# Altium schematic sheet ST_SYS_Board_FPGA.schdoc
size 420 x 297 mm; EDA_Number: ARTIQ; Author: G.Kasprowicz, P. Kulik; CompanyName: WUT ISE; DrawnBy: G.Kasprowicz, P. Kulik; Organization: WUT ISE; DocumentNumber: 7; SheetNumber: 7; ModifiedBy: -; CheckedDate: -; Title2: FPGA; Designer: G.Kasprowicz, P. Kulik; ModifiedDate: -; ProjectName: Sensor Box
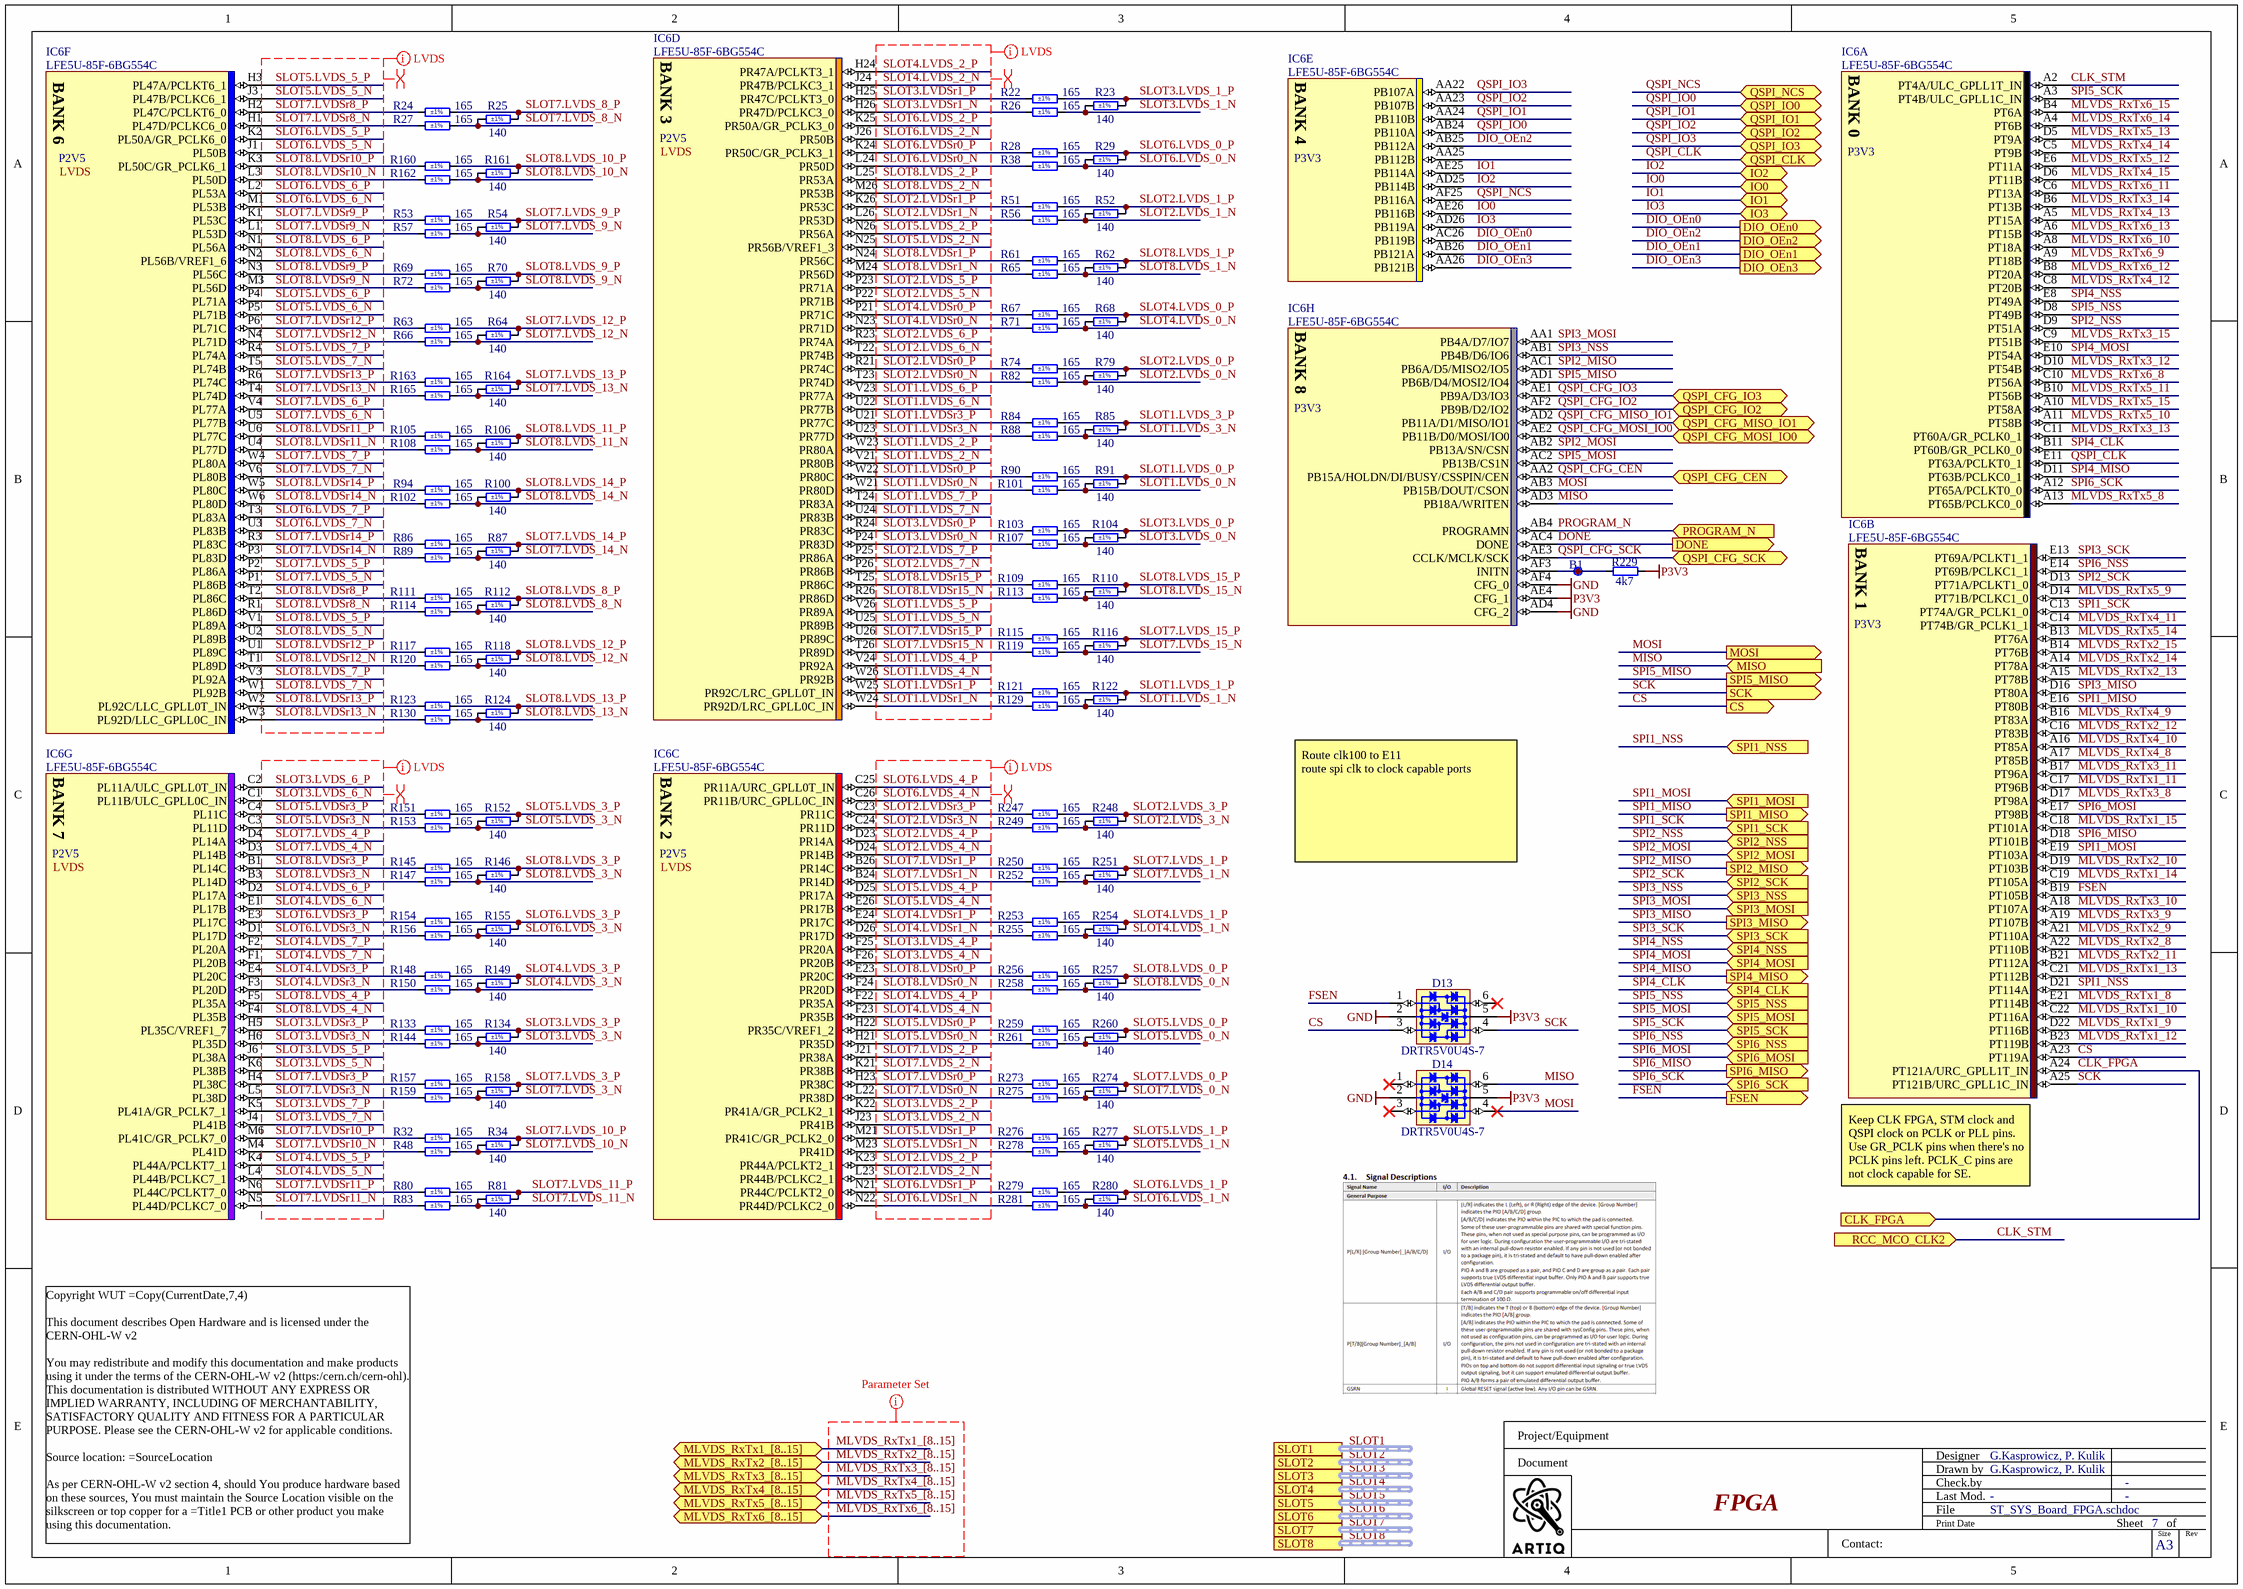
[diagram p0: ST_SYS_Board_FPGA.schdoc]

## Parts
B1  SMD Pad  [C75]  (value not drawn)
D13  DRTR5V0U4S-7  [SOT65P210X110-6N]
D14  DRTR5V0U4S-7  [SOT65P210X110-6N]
IC6  LFE5U-85F-6BG554C  [BGA554C80P26X26_2300X2300X176]  (parts A,B,C,D,E,F,G,H of 15)
R22  165  Tolerance: ±1%  [RESC0603X28N]
R23  140  Tolerance: ±1%  [RESC0603X28N]
R24  165  Tolerance: ±1%  [RESC0603X28N]
R25  140  Tolerance: ±1%  [RESC0603X28N]
R26  165  Tolerance: ±1%  [RESC0603X28N]
R27  165  Tolerance: ±1%  [RESC0603X28N]
R28  165  Tolerance: ±1%  [RESC0603X28N]
R29  140  Tolerance: ±1%  [RESC0603X28N]
R32  165  Tolerance: ±1%  [RESC0603X28N]
R34  140  Tolerance: ±1%  [RESC0603X28N]
R38  165  Tolerance: ±1%  [RESC0603X28N]
R48  165  Tolerance: ±1%  [RESC0603X28N]
R51  165  Tolerance: ±1%  [RESC0603X28N]
R52  140  Tolerance: ±1%  [RESC0603X28N]
R53  165  Tolerance: ±1%  [RESC0603X28N]
R54  140  Tolerance: ±1%  [RESC0603X28N]
R56  165  Tolerance: ±1%  [RESC0603X28N]
R57  165  Tolerance: ±1%  [RESC0603X28N]
R61  165  Tolerance: ±1%  [RESC0603X28N]
R62  140  Tolerance: ±1%  [RESC0603X28N]
R63  165  Tolerance: ±1%  [RESC0603X28N]
R64  140  Tolerance: ±1%  [RESC0603X28N]
R65  165  Tolerance: ±1%  [RESC0603X28N]
R66  165  Tolerance: ±1%  [RESC0603X28N]
R67  165  Tolerance: ±1%  [RESC0603X28N]
R68  140  Tolerance: ±1%  [RESC0603X28N]
R69  165  Tolerance: ±1%  [RESC0603X28N]
R70  140  Tolerance: ±1%  [RESC0603X28N]
R71  165  Tolerance: ±1%  [RESC0603X28N]
R72  165  Tolerance: ±1%  [RESC0603X28N]
R74  165  Tolerance: ±1%  [RESC0603X28N]
R79  140  Tolerance: ±1%  [RESC0603X28N]
R80  165  Tolerance: ±1%  [RESC0603X28N]
R81  140  Tolerance: ±1%  [RESC0603X28N]
R82  165  Tolerance: ±1%  [RESC0603X28N]
R83  165  Tolerance: ±1%  [RESC0603X28N]
R84  165  Tolerance: ±1%  [RESC0603X28N]
R85  140  Tolerance: ±1%  [RESC0603X28N]
R86  165  Tolerance: ±1%  [RESC0603X28N]
R87  140  Tolerance: ±1%  [RESC0603X28N]
R88  165  Tolerance: ±1%  [RESC0603X28N]
R89  165  Tolerance: ±1%  [RESC0603X28N]
R90  165  Tolerance: ±1%  [RESC0603X28N]
R91  140  Tolerance: ±1%  [RESC0603X28N]
R94  165  Tolerance: ±1%  [RESC0603X28N]
R100  140  Tolerance: ±1%  [RESC0603X28N]
R101  165  Tolerance: ±1%  [RESC0603X28N]
R102  165  Tolerance: ±1%  [RESC0603X28N]
R103  165  Tolerance: ±1%  [RESC0603X28N]
R104  140  Tolerance: ±1%  [RESC0603X28N]
R105  165  Tolerance: ±1%  [RESC0603X28N]
R106  140  Tolerance: ±1%  [RESC0603X28N]
R107  165  Tolerance: ±1%  [RESC0603X28N]
R108  165  Tolerance: ±1%  [RESC0603X28N]
R109  165  Tolerance: ±1%  [RESC0603X28N]
R110  140  Tolerance: ±1%  [RESC0603X28N]
R111  165  Tolerance: ±1%  [RESC0603X28N]
R112  140  Tolerance: ±1%  [RESC0603X28N]
R113  165  Tolerance: ±1%  [RESC0603X28N]
R114  165  Tolerance: ±1%  [RESC0603X28N]
R115  165  Tolerance: ±1%  [RESC0603X28N]
R116  140  Tolerance: ±1%  [RESC0603X28N]
R117  165  Tolerance: ±1%  [RESC0603X28N]
R118  140  Tolerance: ±1%  [RESC0603X28N]
R119  165  Tolerance: ±1%  [RESC0603X28N]
R120  165  Tolerance: ±1%  [RESC0603X28N]
R121  165  Tolerance: ±1%  [RESC0603X28N]
R122  140  Tolerance: ±1%  [RESC0603X28N]
R123  165  Tolerance: ±1%  [RESC0603X28N]
R124  140  Tolerance: ±1%  [RESC0603X28N]
R129  165  Tolerance: ±1%  [RESC0603X28N]
R130  165  Tolerance: ±1%  [RESC0603X28N]
R133  165  Tolerance: ±1%  [RESC0603X28N]
R134  140  Tolerance: ±1%  [RESC0603X28N]
R144  165  Tolerance: ±1%  [RESC0603X28N]
R145  165  Tolerance: ±1%  [RESC0603X28N]
R146  140  Tolerance: ±1%  [RESC0603X28N]
R147  165  Tolerance: ±1%  [RESC0603X28N]
R148  165  Tolerance: ±1%  [RESC0603X28N]
R149  140  Tolerance: ±1%  [RESC0603X28N]
R150  165  Tolerance: ±1%  [RESC0603X28N]
R151  165  Tolerance: ±1%  [RESC0603X28N]
R152  140  Tolerance: ±1%  [RESC0603X28N]
R153  165  Tolerance: ±1%  [RESC0603X28N]
R154  165  Tolerance: ±1%  [RESC0603X28N]
R155  140  Tolerance: ±1%  [RESC0603X28N]
R156  165  Tolerance: ±1%  [RESC0603X28N]
R157  165  Tolerance: ±1%  [RESC0603X28N]
R158  140  Tolerance: ±1%  [RESC0603X28N]
R159  165  Tolerance: ±1%  [RESC0603X28N]
R160  165  Tolerance: ±1%  [RESC0603X28N]
R161  140  Tolerance: ±1%  [RESC0603X28N]
R162  165  Tolerance: ±1%  [RESC0603X28N]
R163  165  Tolerance: ±1%  [RESC0603X28N]
R164  140  Tolerance: ±1%  [RESC0603X28N]
R165  165  Tolerance: ±1%  [RESC0603X28N]
R229  4k7  [RESC1005X40N]
R247  165  Tolerance: ±1%  [RESC0603X28N]
R248  140  Tolerance: ±1%  [RESC0603X28N]
R249  165  Tolerance: ±1%  [RESC0603X28N]
R250  165  Tolerance: ±1%  [RESC0603X28N]
R251  140  Tolerance: ±1%  [RESC0603X28N]
R252  165  Tolerance: ±1%  [RESC0603X28N]
R253  165  Tolerance: ±1%  [RESC0603X28N]
R254  140  Tolerance: ±1%  [RESC0603X28N]
R255  165  Tolerance: ±1%  [RESC0603X28N]
R256  165  Tolerance: ±1%  [RESC0603X28N]
R257  140  Tolerance: ±1%  [RESC0603X28N]
R258  165  Tolerance: ±1%  [RESC0603X28N]
R259  165  Tolerance: ±1%  [RESC0603X28N]
R260  140  Tolerance: ±1%  [RESC0603X28N]
R261  165  Tolerance: ±1%  [RESC0603X28N]
R273  165  Tolerance: ±1%  [RESC0603X28N]
R274  140  Tolerance: ±1%  [RESC0603X28N]
R275  165  Tolerance: ±1%  [RESC0603X28N]
R276  165  Tolerance: ±1%  [RESC0603X28N]
R277  140  Tolerance: ±1%  [RESC0603X28N]
R278  165  Tolerance: ±1%  [RESC0603X28N]
R279  165  Tolerance: ±1%  [RESC0603X28N]
R280  140  Tolerance: ±1%  [RESC0603X28N]
R281  165  Tolerance: ±1%  [RESC0603X28N]

## Ports
CLK_FPGA (in), CS (out), DIO_OEn0 (out), DIO_OEn1 (out), DIO_OEn2 (out), DIO_OEn3 (out), DONE (out), FSEN (out), IO0 (bidir), IO1 (bidir), IO2 (bidir), IO3 (bidir), MISO (in), MLVDS_RxTx1_[8..15] (bidir), MLVDS_RxTx2_[8..15] (bidir), MLVDS_RxTx3_[8..15] (bidir), MLVDS_RxTx4_[8..15] (bidir), MLVDS_RxTx5_[8..15] (bidir), MLVDS_RxTx6_[8..15] (bidir), MOSI (out), PROGRAM_N (in), QSPI_CFG_CEN (bidir), QSPI_CFG_IO2 (bidir), QSPI_CFG_IO3 (bidir), QSPI_CFG_MISO_IO1 (bidir), QSPI_CFG_MOSI_IO0 (bidir), QSPI_CFG_SCK (bidir), QSPI_CLK (bidir), QSPI_IO0 (bidir), QSPI_IO1 (bidir), QSPI_IO2 (bidir), QSPI_IO3 (bidir), QSPI_NCS (bidir), RCC_MCO_CLK2 (in), SCK (out), SLOT1 (harness SLOT), SLOT2 (harness SLOT), SLOT3 (harness SLOT), SLOT4 (harness SLOT), SLOT5 (harness SLOT), SLOT6 (harness SLOT), SLOT7 (harness SLOT), SLOT8 (harness SLOT), SPI1_MISO (out), SPI1_MOSI (in), SPI1_NSS (in), SPI1_SCK (in), SPI2_MISO (out), SPI2_MOSI (in), SPI2_NSS (in), SPI2_SCK (in), SPI3_MISO (out), SPI3_MOSI (in), SPI3_NSS (in), SPI3_SCK (in), SPI4_CLK (in), SPI4_MISO (out), SPI4_MOSI (in), SPI4_NSS (in), SPI5_MISO (out), SPI5_MOSI (in), SPI5_NSS (in), SPI5_SCK (in), SPI6_MISO (out), SPI6_MOSI (in), SPI6_NSS (in), SPI6_SCK (in)

## Nets
GND: D13.2(GND) D14.2(GND) IC6.AD4(CFG_2) IC6.AF4(CFG_0)
P3V3: D13.5(VBUS) D14.5(VBUS) IC6.AE4(CFG_1) R229.2
CLK_FPGA: IC6.A24(PT121A/URC_GPLL1T_IN) ; port CLK_FPGA
CLK_STM: IC6.A2(PT4A/ULC_GPLL1T_IN) ; port RCC_MCO_CLK2
CS: D13.3(I/O2) IC6.A23(PT119A) ; port CS
DIO_OEn0: IC6.AC26(PB119B) ; port DIO_OEn0
DIO_OEn1: IC6.AB26(PB121A) ; port DIO_OEn1
DIO_OEn2: IC6.AB25(PB112A) ; port DIO_OEn2
DIO_OEn3: IC6.AA26(PB121B) ; port DIO_OEn3
DONE: IC6.AC4(DONE) ; port DONE
FSEN: D13.1(I/O1) IC6.B19(PT105B) ; port FSEN
IO0: IC6.AE26(PB116B) ; port IO0
IO1: IC6.AE25(PB114A) ; port IO1
IO2: IC6.AD25(PB114B) ; port IO2
IO3: IC6.AD26(PB119A) ; port IO3
MISO: D14.6(I/O4) IC6.AD3(PB18A/WRITEN) ; port MISO
MLVDS_RxTx1_8: IC6.E21(PT114B)
MLVDS_RxTx1_9: IC6.D22(PT116B)
MLVDS_RxTx1_10: IC6.C22(PT116A)
MLVDS_RxTx1_11: IC6.C17(PT96B)
MLVDS_RxTx1_12: IC6.B23(PT119B)
MLVDS_RxTx1_13: IC6.C21(PT112B)
MLVDS_RxTx1_14: IC6.C19(PT105A)
MLVDS_RxTx1_15: IC6.C18(PT101A)
MLVDS_RxTx2_8: IC6.A22(PT110B)
MLVDS_RxTx2_9: IC6.A21(PT110A)
MLVDS_RxTx2_10: IC6.D19(PT103B)
MLVDS_RxTx2_11: IC6.B21(PT112A)
MLVDS_RxTx2_12: IC6.C16(PT83B)
MLVDS_RxTx2_13: IC6.A15(PT78B)
MLVDS_RxTx2_14: IC6.A14(PT78A)
MLVDS_RxTx2_15: IC6.B14(PT76B)
MLVDS_RxTx3_8: IC6.D17(PT98A)
MLVDS_RxTx3_9: IC6.A19(PT107B)
MLVDS_RxTx3_10: IC6.A18(PT107A)
MLVDS_RxTx3_11: IC6.B17(PT96A)
MLVDS_RxTx3_12: IC6.D10(PT54B)
MLVDS_RxTx3_13: IC6.C11(PT60A/GR_PCLK0_1)
MLVDS_RxTx3_14: IC6.B6(PT13B)
MLVDS_RxTx3_15: IC6.C9(PT51B)
MLVDS_RxTx4_8: IC6.A17(PT85B)
MLVDS_RxTx4_9: IC6.B16(PT83A)
MLVDS_RxTx4_10: IC6.A16(PT85A)
MLVDS_RxTx4_11: IC6.C14(PT74B/GR_PCLK1_1)
MLVDS_RxTx4_12: IC6.C8(PT20B)
MLVDS_RxTx4_13: IC6.A5(PT15A)
MLVDS_RxTx4_14: IC6.C5(PT9B)
MLVDS_RxTx4_15: IC6.D6(PT11B)
MLVDS_RxTx5_8: IC6.A13(PT65B/PCLKC0_0)
MLVDS_RxTx5_9: IC6.D14(PT71B/PCLKC1_0)
MLVDS_RxTx5_10: IC6.A11(PT58B)
MLVDS_RxTx5_11: IC6.B10(PT56B)
MLVDS_RxTx5_12: IC6.E6(PT11A)
MLVDS_RxTx5_13: IC6.D5(PT9A)
MLVDS_RxTx5_14: IC6.B13(PT76A)
MLVDS_RxTx5_15: IC6.A10(PT58A)
MLVDS_RxTx6_8: IC6.C10(PT56A)
MLVDS_RxTx6_9: IC6.A9(PT18B)
MLVDS_RxTx6_10: IC6.A8(PT18A)
MLVDS_RxTx6_11: IC6.C6(PT13A)
MLVDS_RxTx6_12: IC6.B8(PT20A)
MLVDS_RxTx6_13: IC6.A6(PT15B)
MLVDS_RxTx6_14: IC6.A4(PT6B)
MLVDS_RxTx6_15: IC6.B4(PT6A)
MOSI: D14.4(I/O3) IC6.AB3(PB15B/DOUT/CSON) ; port MOSI
PROGRAM_N: IC6.AB4(PROGRAMN) ; port PROGRAM_N
QSPI_CFG_CEN: IC6.AA2(PB15A/HOLDN/DI/BUSY/CSSPIN/CEN) ; port QSPI_CFG_CEN
QSPI_CFG_IO2: IC6.AF2(PB9B/D2/IO2) ; port QSPI_CFG_IO2
QSPI_CFG_IO3: IC6.AE1(PB9A/D3/IO3) ; port QSPI_CFG_IO3
QSPI_CFG_MISO_IO1: IC6.AD2(PB11A/D1/MISO/IO1) ; port QSPI_CFG_MISO_IO1
QSPI_CFG_MOSI_IO0: IC6.AE2(PB11B/D0/MOSI/IO0) ; port QSPI_CFG_MOSI_IO0
QSPI_CFG_SCK: IC6.AE3(CCLK/MCLK/SCK) ; port QSPI_CFG_SCK
QSPI_CLK: IC6.E11(PT63A/PCLKT0_1) ; port QSPI_CLK
QSPI_IO0: IC6.AB24(PB110A) ; port QSPI_IO0
QSPI_IO1: IC6.AA24(PB110B) ; port QSPI_IO1
QSPI_IO2: IC6.AA23(PB107B) ; port QSPI_IO2
QSPI_IO3: IC6.AA22(PB107A) ; port QSPI_IO3
QSPI_NCS: IC6.AF25(PB116A) ; port QSPI_NCS
SCK: D13.4(I/O3) IC6.A25(PT121B/URC_GPLL1C_IN) ; port SCK
SLOT1.LVDS_0_N: R91.1 R101.2
SLOT1.LVDS_0_P: R90.2 R91.2
SLOT1.LVDS_1_N: R122.1 R129.2
SLOT1.LVDS_1_P: R121.2 R122.2
SLOT1.LVDS_2_N: IC6.V21(PR80B)
SLOT1.LVDS_2_P: IC6.W23(PR80A)
SLOT1.LVDS_3_N: R85.1 R88.2
SLOT1.LVDS_3_P: R84.2 R85.2
SLOT1.LVDS_4_N: IC6.W26(PR92B)
SLOT1.LVDS_4_P: IC6.V24(PR92A)
SLOT1.LVDS_5_N: IC6.U25(PR89B)
SLOT1.LVDS_5_P: IC6.V26(PR89A)
SLOT1.LVDS_6_N: IC6.U22(PR77B)
SLOT1.LVDS_6_P: IC6.V23(PR77A)
SLOT1.LVDS_7_N: IC6.U24(PR83B)
SLOT1.LVDS_7_P: IC6.T24(PR83A)
SLOT1.LVDSr0_N: IC6.W21(PR80D) R101.1
SLOT1.LVDSr0_P: IC6.W22(PR80C) R90.1
SLOT1.LVDSr1_N: IC6.W24(PR92D/LRC_GPLL0C_IN) R129.1
SLOT1.LVDSr1_P: IC6.W25(PR92C/LRC_GPLL0T_IN) R121.1
SLOT1.LVDSr3_N: IC6.U23(PR77D) R88.1
SLOT1.LVDSr3_P: IC6.U21(PR77C) R84.1
SLOT2.LVDS_0_N: R79.1 R82.2
SLOT2.LVDS_0_P: R74.2 R79.2
SLOT2.LVDS_1_N: R52.1 R56.2
SLOT2.LVDS_1_P: R51.2 R52.2
SLOT2.LVDS_2_N: IC6.L23(PR44B/PCLKC2_1)
SLOT2.LVDS_2_P: IC6.K23(PR44A/PCLKT2_1)
SLOT2.LVDS_3_N: R248.1 R249.2
SLOT2.LVDS_3_P: R247.2 R248.2
SLOT2.LVDS_4_N: IC6.D24(PR14B)
SLOT2.LVDS_4_P: IC6.D23(PR14A)
SLOT2.LVDS_5_N: IC6.P22(PR71B)
SLOT2.LVDS_5_P: IC6.P23(PR71A)
SLOT2.LVDS_6_N: IC6.T22(PR74B)
SLOT2.LVDS_6_P: IC6.R23(PR74A)
SLOT2.LVDS_7_N: IC6.P26(PR86B)
SLOT2.LVDS_7_P: IC6.P25(PR86A)
SLOT2.LVDSr0_N: IC6.T23(PR74D) R82.1
SLOT2.LVDSr0_P: IC6.R21(PR74C) R74.1
SLOT2.LVDSr1_N: IC6.L26(PR53D) R56.1
SLOT2.LVDSr1_P: IC6.K26(PR53C) R51.1
SLOT2.LVDSr3_N: IC6.C24(PR11D) R249.1
SLOT2.LVDSr3_P: IC6.C23(PR11C) R247.1
SLOT3.LVDS_0_N: R104.1 R107.2
SLOT3.LVDS_0_P: R103.2 R104.2
SLOT3.LVDS_1_N: R23.1 R26.2
SLOT3.LVDS_1_P: R22.2 R23.2
SLOT3.LVDS_2_N: IC6.J23(PR41B)
SLOT3.LVDS_2_P: IC6.K22(PR41A/GR_PCLK2_1)
SLOT3.LVDS_3_N: R134.1 R144.2
SLOT3.LVDS_3_P: R133.2 R134.2
SLOT3.LVDS_4_N: IC6.F26(PR20B)
SLOT3.LVDS_4_P: IC6.F25(PR20A)
SLOT3.LVDS_5_N: IC6.K6(PL38B)
SLOT3.LVDS_5_P: IC6.J6(PL38A)
SLOT3.LVDS_6_N: IC6.C1(PL11B/ULC_GPLL0C_IN)
SLOT3.LVDS_6_P: IC6.C2(PL11A/ULC_GPLL0T_IN)
SLOT3.LVDS_7_N: IC6.J4(PL41B)
SLOT3.LVDS_7_P: IC6.K5(PL41A/GR_PCLK7_1)
SLOT3.LVDSr0_N: IC6.P24(PR83D) R107.1
SLOT3.LVDSr0_P: IC6.R24(PR83C) R103.1
SLOT3.LVDSr1_N: IC6.H26(PR47D/PCLKC3_0) R26.1
SLOT3.LVDSr1_P: IC6.H25(PR47C/PCLKT3_0) R22.1
SLOT3.LVDSr3_N: IC6.H6(PL35D) R144.1
SLOT3.LVDSr3_P: IC6.H5(PL35C/VREF1_7) R133.1
SLOT4.LVDS_0_N: R68.1 R71.2
SLOT4.LVDS_0_P: R67.2 R68.2
SLOT4.LVDS_1_N: R254.1 R255.2
SLOT4.LVDS_1_P: R253.2 R254.2
SLOT4.LVDS_2_N: IC6.J24(PR47B/PCLKC3_1)
SLOT4.LVDS_2_P: IC6.H24(PR47A/PCLKT3_1)
SLOT4.LVDS_3_N: R149.1 R150.2
SLOT4.LVDS_3_P: R148.2 R149.2
SLOT4.LVDS_4_N: IC6.F23(PR35B)
SLOT4.LVDS_4_P: IC6.F22(PR35A)
SLOT4.LVDS_5_N: IC6.L4(PL44B/PCLKC7_1)
SLOT4.LVDS_5_P: IC6.K4(PL44A/PCLKT7_1)
SLOT4.LVDS_6_N: IC6.E1(PL17B)
SLOT4.LVDS_6_P: IC6.D2(PL17A)
SLOT4.LVDS_7_N: IC6.F1(PL20B)
SLOT4.LVDS_7_P: IC6.F2(PL20A)
SLOT4.LVDSr0_N: IC6.N23(PR71D) R71.1
SLOT4.LVDSr0_P: IC6.P21(PR71C) R67.1
SLOT4.LVDSr1_N: IC6.D26(PR17D) R255.1
SLOT4.LVDSr1_P: IC6.E24(PR17C) R253.1
SLOT4.LVDSr3_N: IC6.F3(PL20D) R150.1
SLOT4.LVDSr3_P: IC6.E4(PL20C) R148.1
SLOT5.LVDS_0_N: R260.1 R261.2
SLOT5.LVDS_0_P: R259.2 R260.2
SLOT5.LVDS_1_N: R277.1 R278.2
SLOT5.LVDS_1_P: R276.2 R277.2
SLOT5.LVDS_2_N: IC6.N25(PR56B/VREF1_3)
SLOT5.LVDS_2_P: IC6.N26(PR56A)
SLOT5.LVDS_3_N: R152.1 R153.2
SLOT5.LVDS_3_P: R151.2 R152.2
SLOT5.LVDS_4_N: IC6.E26(PR17B)
SLOT5.LVDS_4_P: IC6.D25(PR17A)
SLOT5.LVDS_5_N: IC6.J3(PL47B/PCLKC6_1)
SLOT5.LVDS_5_P: IC6.H3(PL47A/PCLKT6_1)
SLOT5.LVDS_6_N: IC6.P5(PL71B)
SLOT5.LVDS_6_P: IC6.P4(PL71A)
SLOT5.LVDS_7_N: IC6.T5(PL74B)
SLOT5.LVDS_7_P: IC6.R4(PL74A)
SLOT5.LVDSr0_N: IC6.H21(PR35D) R261.1
SLOT5.LVDSr0_P: IC6.H22(PR35C/VREF1_2) R259.1
SLOT5.LVDSr1_N: IC6.M23(PR41D) R278.1
SLOT5.LVDSr1_P: IC6.M21(PR41C/GR_PCLK2_0) R276.1
SLOT5.LVDSr3_N: IC6.C3(PL11D) R153.1
SLOT5.LVDSr3_P: IC6.C4(PL11C) R151.1
SLOT6.LVDS_0_N: R29.1 R38.2
SLOT6.LVDS_0_P: R28.2 R29.2
SLOT6.LVDS_1_N: R280.1 R281.2
SLOT6.LVDS_1_P: R279.2 R280.2
SLOT6.LVDS_2_N: IC6.J26(PR50B)
SLOT6.LVDS_2_P: IC6.K25(PR50A/GR_PCLK3_0)
SLOT6.LVDS_3_N: R155.1 R156.2
SLOT6.LVDS_3_P: R154.2 R155.2
SLOT6.LVDS_4_N: IC6.C26(PR11B/URC_GPLL0C_IN)
SLOT6.LVDS_4_P: IC6.C25(PR11A/URC_GPLL0T_IN)
SLOT6.LVDS_5_N: IC6.J1(PL50B)
SLOT6.LVDS_5_P: IC6.K2(PL50A/GR_PCLK6_0)
SLOT6.LVDS_6_N: IC6.M1(PL53B)
SLOT6.LVDS_6_P: IC6.L2(PL53A)
SLOT6.LVDS_7_N: IC6.U3(PL83B)
SLOT6.LVDS_7_P: IC6.T3(PL83A)
SLOT6.LVDSr0_N: IC6.L24(PR50D) R38.1
SLOT6.LVDSr0_P: IC6.K24(PR50C/GR_PCLK3_1) R28.1
SLOT6.LVDSr1_N: IC6.N22(PR44D/PCLKC2_0) R281.1
SLOT6.LVDSr1_P: IC6.N21(PR44C/PCLKT2_0) R279.1
SLOT6.LVDSr3_N: IC6.D1(PL17D) R156.1
SLOT6.LVDSr3_P: IC6.E3(PL17C) R154.1
SLOT7.LVDS_0_N: R274.1 R275.2
SLOT7.LVDS_0_P: R273.2 R274.2
SLOT7.LVDS_1_N: R251.1 R252.2
SLOT7.LVDS_1_P: R250.2 R251.2
SLOT7.LVDS_2_N: IC6.K21(PR38B)
SLOT7.LVDS_2_P: IC6.J21(PR38A)
SLOT7.LVDS_3_N: R158.1 R159.2
SLOT7.LVDS_3_P: R157.2 R158.2
SLOT7.LVDS_4_N: IC6.D3(PL14B)
SLOT7.LVDS_4_P: IC6.D4(PL14A)
SLOT7.LVDS_5_N: IC6.P1(PL86B)
SLOT7.LVDS_5_P: IC6.P2(PL86A)
SLOT7.LVDS_6_N: IC6.U5(PL77B)
SLOT7.LVDS_6_P: IC6.V4(PL77A)
SLOT7.LVDS_7_N: IC6.V6(PL80B)
SLOT7.LVDS_7_P: IC6.W4(PL80A)
SLOT7.LVDS_8_N: R25.1 R27.2
SLOT7.LVDS_8_P: R24.2 R25.2
SLOT7.LVDS_9_N: R54.1 R57.2
SLOT7.LVDS_9_P: R53.2 R54.2
SLOT7.LVDS_10_N: R34.1 R48.2
SLOT7.LVDS_10_P: R32.2 R34.2
SLOT7.LVDS_11_N: R81.1 R83.2
SLOT7.LVDS_11_P: R80.2 R81.2
SLOT7.LVDS_12_N: R64.1 R66.2
SLOT7.LVDS_12_P: R63.2 R64.2
SLOT7.LVDS_13_N: R164.1 R165.2
SLOT7.LVDS_13_P: R163.2 R164.2
SLOT7.LVDS_14_N: R87.1 R89.2
SLOT7.LVDS_14_P: R86.2 R87.2
SLOT7.LVDS_15_N: R116.1 R119.2
SLOT7.LVDS_15_P: R115.2 R116.2
SLOT7.LVDSr0_N: IC6.L22(PR38D) R275.1
SLOT7.LVDSr0_P: IC6.H23(PR38C) R273.1
SLOT7.LVDSr1_N: IC6.B24(PR14D) R252.1
SLOT7.LVDSr1_P: IC6.B26(PR14C) R250.1
SLOT7.LVDSr3_N: IC6.L5(PL38D) R159.1
SLOT7.LVDSr3_P: IC6.H4(PL38C) R157.1
SLOT7.LVDSr8_N: IC6.H1(PL47D/PCLKC6_0) R27.1
SLOT7.LVDSr8_P: IC6.H2(PL47C/PCLKT6_0) R24.1
SLOT7.LVDSr9_N: IC6.L1(PL53D) R57.1
SLOT7.LVDSr9_P: IC6.K1(PL53C) R53.1
SLOT7.LVDSr10_N: IC6.M4(PL41D) R48.1
SLOT7.LVDSr10_P: IC6.M6(PL41C/GR_PCLK7_0) R32.1
SLOT7.LVDSr11_N: IC6.N5(PL44D/PCLKC7_0) R83.1
SLOT7.LVDSr11_P: IC6.N6(PL44C/PCLKT7_0) R80.1
SLOT7.LVDSr12_N: IC6.N4(PL71D) R66.1
SLOT7.LVDSr12_P: IC6.P6(PL71C) R63.1
SLOT7.LVDSr13_N: IC6.T4(PL74D) R165.1
SLOT7.LVDSr13_P: IC6.R6(PL74C) R163.1
SLOT7.LVDSr14_N: IC6.P3(PL83D) R89.1
SLOT7.LVDSr14_P: IC6.R3(PL83C) R86.1
SLOT7.LVDSr15_N: IC6.T26(PR89D) R119.1
SLOT7.LVDSr15_P: IC6.U26(PR89C) R115.1
SLOT8.LVDS_0_N: R257.1 R258.2
SLOT8.LVDS_0_P: R256.2 R257.2
SLOT8.LVDS_1_N: R62.1 R65.2
SLOT8.LVDS_1_P: R61.2 R62.2
SLOT8.LVDS_2_N: IC6.M26(PR53B)
SLOT8.LVDS_2_P: IC6.L25(PR53A)
SLOT8.LVDS_3_N: R146.1 R147.2
SLOT8.LVDS_3_P: R145.2 R146.2
SLOT8.LVDS_4_N: IC6.F4(PL35B)
SLOT8.LVDS_4_P: IC6.F5(PL35A)
SLOT8.LVDS_5_N: IC6.U2(PL89B)
SLOT8.LVDS_5_P: IC6.V1(PL89A)
SLOT8.LVDS_6_N: IC6.N2(PL56B/VREF1_6)
SLOT8.LVDS_6_P: IC6.N1(PL56A)
SLOT8.LVDS_7_N: IC6.W1(PL92B)
SLOT8.LVDS_7_P: IC6.V3(PL92A)
SLOT8.LVDS_8_N: R112.1 R114.2
SLOT8.LVDS_8_P: R111.2 R112.2
SLOT8.LVDS_9_N: R70.1 R72.2
SLOT8.LVDS_9_P: R69.2 R70.2
SLOT8.LVDS_10_N: R161.1 R162.2
SLOT8.LVDS_10_P: R160.2 R161.2
SLOT8.LVDS_11_N: R106.1 R108.2
SLOT8.LVDS_11_P: R105.2 R106.2
SLOT8.LVDS_12_N: R118.1 R120.2
SLOT8.LVDS_12_P: R117.2 R118.2
SLOT8.LVDS_13_N: R124.1 R130.2
SLOT8.LVDS_13_P: R123.2 R124.2
SLOT8.LVDS_14_N: R100.1 R102.2
SLOT8.LVDS_14_P: R94.2 R100.2
SLOT8.LVDS_15_N: R110.1 R113.2
SLOT8.LVDS_15_P: R109.2 R110.2
SLOT8.LVDSr0_N: IC6.F24(PR20D) R258.1
SLOT8.LVDSr0_P: IC6.E23(PR20C) R256.1
SLOT8.LVDSr1_N: IC6.M24(PR56D) R65.1
SLOT8.LVDSr1_P: IC6.N24(PR56C) R61.1
SLOT8.LVDSr3_N: IC6.B3(PL14D) R147.1
SLOT8.LVDSr3_P: IC6.B1(PL14C) R145.1
SLOT8.LVDSr8_N: IC6.R1(PL86D) R114.1
SLOT8.LVDSr8_P: IC6.T2(PL86C) R111.1
SLOT8.LVDSr9_N: IC6.M3(PL56D) R72.1
SLOT8.LVDSr9_P: IC6.N3(PL56C) R69.1
SLOT8.LVDSr10_N: IC6.L3(PL50D) R162.1
SLOT8.LVDSr10_P: IC6.K3(PL50C/GR_PCLK6_1) R160.1
SLOT8.LVDSr11_N: IC6.U4(PL77D) R108.1
SLOT8.LVDSr11_P: IC6.U6(PL77C) R105.1
SLOT8.LVDSr12_N: IC6.T1(PL89D) R120.1
SLOT8.LVDSr12_P: IC6.U1(PL89C) R117.1
SLOT8.LVDSr13_N: IC6.W3(PL92D/LLC_GPLL0C_IN) R130.1
SLOT8.LVDSr13_P: IC6.W2(PL92C/LLC_GPLL0T_IN) R123.1
SLOT8.LVDSr14_N: IC6.W6(PL80D) R102.1
SLOT8.LVDSr14_P: IC6.W5(PL80C) R94.1
SLOT8.LVDSr15_N: IC6.R26(PR86D) R113.1
SLOT8.LVDSr15_P: IC6.T25(PR86C) R109.1
SPI1_MISO: IC6.E16(PT80B) ; port SPI1_MISO
SPI1_MOSI: IC6.E19(PT103A) ; port SPI1_MOSI
SPI1_NSS: IC6.D21(PT114A) ; port SPI1_NSS
SPI1_SCK: IC6.C13(PT74A/GR_PCLK1_0) ; port SPI1_SCK
SPI2_MISO: IC6.AC1(PB6A/D5/MISO2/IO5) ; port SPI2_MISO
SPI2_MOSI: IC6.AB2(PB13A/SN/CSN) ; port SPI2_MOSI
SPI2_NSS: IC6.D9(PT51A) ; port SPI2_NSS
SPI2_SCK: IC6.D13(PT71A/PCLKT1_0) ; port SPI2_SCK
SPI3_MISO: IC6.D16(PT80A) ; port SPI3_MISO
SPI3_MOSI: IC6.AA1(PB4A/D7/IO7) ; port SPI3_MOSI
SPI3_NSS: IC6.AB1(PB4B/D6/IO6) ; port SPI3_NSS
SPI3_SCK: IC6.E13(PT69A/PCLKT1_1) ; port SPI3_SCK
SPI4_CLK: IC6.B11(PT60B/GR_PCLK0_0) ; port SPI4_CLK
SPI4_MISO: IC6.D11(PT63B/PCLKC0_1) ; port SPI4_MISO
SPI4_MOSI: IC6.E10(PT54A) ; port SPI4_MOSI
SPI4_NSS: IC6.E8(PT49A) ; port SPI4_NSS
SPI5_MISO: IC6.AD1(PB6B/D4/MOSI2/IO4) ; port SPI5_MISO
SPI5_MOSI: IC6.AC2(PB13B/CS1N) ; port SPI5_MOSI
SPI5_NSS: IC6.D8(PT49B) ; port SPI5_NSS
SPI5_SCK: IC6.A3(PT4B/ULC_GPLL1C_IN) ; port SPI5_SCK
SPI6_MISO: IC6.D18(PT101B) ; port SPI6_MISO
SPI6_MOSI: IC6.E17(PT98B) ; port SPI6_MOSI
SPI6_NSS: IC6.E14(PT69B/PCLKC1_1) ; port SPI6_NSS
SPI6_SCK: IC6.A12(PT65A/PCLKT0_0) ; port SPI6_SCK
NetB1_1: B1.1 IC6.AF3(INITN) R229.1

Not connected (* = marked no-connect by the designer): D13 6(I/O4)*; D14 1(I/O1)* 3(I/O2)*; IC6 AA25(PB112B)

## Buses and harness runs
bus MLVDS_RxTx1_[8..15] = port MLVDS_RxTx1_[8..15]
bus MLVDS_RxTx2_[8..15] = port MLVDS_RxTx2_[8..15]
bus MLVDS_RxTx3_[8..15] = port MLVDS_RxTx3_[8..15]
bus MLVDS_RxTx4_[8..15] = port MLVDS_RxTx4_[8..15]
bus MLVDS_RxTx5_[8..15] = port MLVDS_RxTx5_[8..15]
bus MLVDS_RxTx6_[8..15] = port MLVDS_RxTx6_[8..15]
harness SLOT1 = port SLOT1
harness SLOT2 = port SLOT2
harness SLOT3 = port SLOT3
harness SLOT4 = port SLOT4
harness SLOT5 = port SLOT5
harness SLOT6 = port SLOT6
harness SLOT7 = port SLOT7
harness SLOT8 = port SLOT8

## Layout directives
net class LVDS: SLOT1.LVDS_2_N, SLOT1.LVDS_2_P, SLOT1.LVDS_4_N, SLOT1.LVDS_4_P, SLOT1.LVDS_5_N, SLOT1.LVDS_5_P, SLOT1.LVDS_6_N, SLOT1.LVDS_6_P, SLOT1.LVDS_7_N, SLOT1.LVDS_7_P, SLOT1.LVDSr0_N, SLOT1.LVDSr0_P, SLOT1.LVDSr1_N, SLOT1.LVDSr1_P, SLOT1.LVDSr3_N, SLOT1.LVDSr3_P, SLOT2.LVDS_2_N, SLOT2.LVDS_2_P, SLOT2.LVDS_4_N, SLOT2.LVDS_4_P, SLOT2.LVDS_5_N, SLOT2.LVDS_5_P, SLOT2.LVDS_6_N, SLOT2.LVDS_6_P, SLOT2.LVDS_7_N, SLOT2.LVDS_7_P, SLOT2.LVDSr0_N, SLOT2.LVDSr0_P, SLOT2.LVDSr1_N, SLOT2.LVDSr1_P, SLOT2.LVDSr3_N, SLOT2.LVDSr3_P, SLOT3.LVDS_2_N, SLOT3.LVDS_2_P, SLOT3.LVDS_4_N, SLOT3.LVDS_4_P, SLOT3.LVDS_5_N, SLOT3.LVDS_5_P, SLOT3.LVDS_6_N, SLOT3.LVDS_6_P, SLOT3.LVDS_7_N, SLOT3.LVDS_7_P, SLOT3.LVDSr0_N, SLOT3.LVDSr0_P, SLOT3.LVDSr1_N, SLOT3.LVDSr1_P, SLOT3.LVDSr3_N, SLOT3.LVDSr3_P, SLOT4.LVDS_2_N, SLOT4.LVDS_2_P, SLOT4.LVDS_4_N, SLOT4.LVDS_4_P, SLOT4.LVDS_5_N, SLOT4.LVDS_5_P, SLOT4.LVDS_6_N, SLOT4.LVDS_6_P, SLOT4.LVDS_7_N, SLOT4.LVDS_7_P, SLOT4.LVDSr0_N, SLOT4.LVDSr0_P, SLOT4.LVDSr1_N, SLOT4.LVDSr1_P, SLOT4.LVDSr3_N, SLOT4.LVDSr3_P, SLOT5.LVDS_2_N, SLOT5.LVDS_2_P, SLOT5.LVDS_4_N, SLOT5.LVDS_4_P, SLOT5.LVDS_5_N, SLOT5.LVDS_5_P, SLOT5.LVDS_6_N, SLOT5.LVDS_6_P, SLOT5.LVDS_7_N, SLOT5.LVDS_7_P, SLOT5.LVDSr0_N, SLOT5.LVDSr0_P, SLOT5.LVDSr1_N, SLOT5.LVDSr1_P, SLOT5.LVDSr3_N, SLOT5.LVDSr3_P, SLOT6.LVDS_2_N, SLOT6.LVDS_2_P, SLOT6.LVDS_4_N, SLOT6.LVDS_4_P, SLOT6.LVDS_5_N, SLOT6.LVDS_5_P, SLOT6.LVDS_6_N, SLOT6.LVDS_6_P, SLOT6.LVDS_7_N, SLOT6.LVDS_7_P, SLOT6.LVDSr0_N, SLOT6.LVDSr0_P, SLOT6.LVDSr1_N, SLOT6.LVDSr1_P, SLOT6.LVDSr3_N, SLOT6.LVDSr3_P, SLOT7.LVDS_2_N, SLOT7.LVDS_2_P, SLOT7.LVDS_4_N, SLOT7.LVDS_4_P, SLOT7.LVDS_5_N, SLOT7.LVDS_5_P, SLOT7.LVDS_6_N, SLOT7.LVDS_6_P, SLOT7.LVDS_7_N, SLOT7.LVDS_7_P, SLOT7.LVDSr0_N, SLOT7.LVDSr0_P, SLOT7.LVDSr1_N, SLOT7.LVDSr1_P, SLOT7.LVDSr3_N, SLOT7.LVDSr3_P, SLOT7.LVDSr8_N, SLOT7.LVDSr8_P, SLOT7.LVDSr9_N, SLOT7.LVDSr9_P, SLOT7.LVDSr10_N, SLOT7.LVDSr10_P, SLOT7.LVDSr11_N, SLOT7.LVDSr11_P, SLOT7.LVDSr12_N, SLOT7.LVDSr12_P, SLOT7.LVDSr13_N, SLOT7.LVDSr13_P, SLOT7.LVDSr14_N, SLOT7.LVDSr14_P, SLOT7.LVDSr15_N, SLOT7.LVDSr15_P, SLOT8.LVDS_2_N, SLOT8.LVDS_2_P, SLOT8.LVDS_4_N, SLOT8.LVDS_4_P, SLOT8.LVDS_5_N, SLOT8.LVDS_5_P, SLOT8.LVDS_6_N, SLOT8.LVDS_6_P, SLOT8.LVDS_7_N, SLOT8.LVDS_7_P, SLOT8.LVDSr0_N, SLOT8.LVDSr0_P, SLOT8.LVDSr1_N, SLOT8.LVDSr1_P, SLOT8.LVDSr3_N, SLOT8.LVDSr3_P, SLOT8.LVDSr8_N, SLOT8.LVDSr8_P, SLOT8.LVDSr9_N, SLOT8.LVDSr9_P, SLOT8.LVDSr10_N, SLOT8.LVDSr10_P, SLOT8.LVDSr11_N, SLOT8.LVDSr11_P, SLOT8.LVDSr12_N, SLOT8.LVDSr12_P, SLOT8.LVDSr13_N, SLOT8.LVDSr13_P, SLOT8.LVDSr14_N, SLOT8.LVDSr14_P, SLOT8.LVDSr15_N, SLOT8.LVDSr15_P
differential pair: SLOT1.LVDS_2_N, SLOT1.LVDS_2_P, SLOT1.LVDS_4_N, SLOT1.LVDS_4_P, SLOT1.LVDS_5_N, SLOT1.LVDS_5_P, SLOT1.LVDS_6_N, SLOT1.LVDS_6_P, SLOT1.LVDS_7_N, SLOT1.LVDS_7_P, SLOT1.LVDSr0_N, SLOT1.LVDSr0_P, SLOT1.LVDSr1_N, SLOT1.LVDSr1_P, SLOT1.LVDSr3_N, SLOT1.LVDSr3_P, SLOT2.LVDS_2_N, SLOT2.LVDS_2_P, SLOT2.LVDS_4_N, SLOT2.LVDS_4_P, SLOT2.LVDS_5_N, SLOT2.LVDS_5_P, SLOT2.LVDS_6_N, SLOT2.LVDS_6_P, SLOT2.LVDS_7_N, SLOT2.LVDS_7_P, SLOT2.LVDSr0_N, SLOT2.LVDSr0_P, SLOT2.LVDSr1_N, SLOT2.LVDSr1_P, SLOT2.LVDSr3_N, SLOT2.LVDSr3_P, SLOT3.LVDS_2_N, SLOT3.LVDS_2_P, SLOT3.LVDS_4_N, SLOT3.LVDS_4_P, SLOT3.LVDS_5_N, SLOT3.LVDS_5_P, SLOT3.LVDS_6_N, SLOT3.LVDS_6_P, SLOT3.LVDS_7_N, SLOT3.LVDS_7_P, SLOT3.LVDSr0_N, SLOT3.LVDSr0_P, SLOT3.LVDSr1_N, SLOT3.LVDSr1_P, SLOT3.LVDSr3_N, SLOT3.LVDSr3_P, SLOT4.LVDS_2_N, SLOT4.LVDS_2_P, SLOT4.LVDS_4_N, SLOT4.LVDS_4_P, SLOT4.LVDS_5_N, SLOT4.LVDS_5_P, SLOT4.LVDS_6_N, SLOT4.LVDS_6_P, SLOT4.LVDS_7_N, SLOT4.LVDS_7_P, SLOT4.LVDSr0_N, SLOT4.LVDSr0_P, SLOT4.LVDSr1_N, SLOT4.LVDSr1_P, SLOT4.LVDSr3_N, SLOT4.LVDSr3_P, SLOT5.LVDS_2_N, SLOT5.LVDS_2_P, SLOT5.LVDS_4_N, SLOT5.LVDS_4_P, SLOT5.LVDS_5_N, SLOT5.LVDS_5_P, SLOT5.LVDS_6_N, SLOT5.LVDS_6_P, SLOT5.LVDS_7_N, SLOT5.LVDS_7_P, SLOT5.LVDSr0_N, SLOT5.LVDSr0_P, SLOT5.LVDSr1_N, SLOT5.LVDSr1_P, SLOT5.LVDSr3_N, SLOT5.LVDSr3_P, SLOT6.LVDS_2_N, SLOT6.LVDS_2_P, SLOT6.LVDS_4_N, SLOT6.LVDS_4_P, SLOT6.LVDS_5_N, SLOT6.LVDS_5_P, SLOT6.LVDS_6_N, SLOT6.LVDS_6_P, SLOT6.LVDS_7_N, SLOT6.LVDS_7_P, SLOT6.LVDSr0_N, SLOT6.LVDSr0_P, SLOT6.LVDSr1_N, SLOT6.LVDSr1_P, SLOT6.LVDSr3_N, SLOT6.LVDSr3_P, SLOT7.LVDS_2_N, SLOT7.LVDS_2_P, SLOT7.LVDS_4_N, SLOT7.LVDS_4_P, SLOT7.LVDS_5_N, SLOT7.LVDS_5_P, SLOT7.LVDS_6_N, SLOT7.LVDS_6_P, SLOT7.LVDS_7_N, SLOT7.LVDS_7_P, SLOT7.LVDSr0_N, SLOT7.LVDSr0_P, SLOT7.LVDSr1_N, SLOT7.LVDSr1_P, SLOT7.LVDSr3_N, SLOT7.LVDSr3_P, SLOT7.LVDSr8_N, SLOT7.LVDSr8_P, SLOT7.LVDSr9_N, SLOT7.LVDSr9_P, SLOT7.LVDSr10_N, SLOT7.LVDSr10_P, SLOT7.LVDSr11_N, SLOT7.LVDSr11_P, SLOT7.LVDSr12_N, SLOT7.LVDSr12_P, SLOT7.LVDSr13_N, SLOT7.LVDSr13_P, SLOT7.LVDSr14_N, SLOT7.LVDSr14_P, SLOT7.LVDSr15_N, SLOT7.LVDSr15_P, SLOT8.LVDS_2_N, SLOT8.LVDS_2_P, SLOT8.LVDS_4_N, SLOT8.LVDS_4_P, SLOT8.LVDS_5_N, SLOT8.LVDS_5_P, SLOT8.LVDS_6_N, SLOT8.LVDS_6_P, SLOT8.LVDS_7_N, SLOT8.LVDS_7_P, SLOT8.LVDSr0_N, SLOT8.LVDSr0_P, SLOT8.LVDSr1_N, SLOT8.LVDSr1_P, SLOT8.LVDSr3_N, SLOT8.LVDSr3_P, SLOT8.LVDSr8_N, SLOT8.LVDSr8_P, SLOT8.LVDSr9_N, SLOT8.LVDSr9_P, SLOT8.LVDSr10_N, SLOT8.LVDSr10_P, SLOT8.LVDSr11_N, SLOT8.LVDSr11_P, SLOT8.LVDSr12_N, SLOT8.LVDSr12_P, SLOT8.LVDSr13_N, SLOT8.LVDSr13_P, SLOT8.LVDSr14_N, SLOT8.LVDSr14_P, SLOT8.LVDSr15_N, SLOT8.LVDSr15_P
net class BUF_IO: MLVDS_RxTx1_[8..15], MLVDS_RxTx2_[8..15], MLVDS_RxTx3_[8..15], MLVDS_RxTx4_[8..15], MLVDS_RxTx5_[8..15], MLVDS_RxTx6_[8..15]

## Notes on the sheet
- LVDS
- P2V5
- P3V3
- Route clk100 to E11
  route spi clk to clock capable ports
- (near IC6) Keep CLK FPGA, STM clock and QSPI clock on PCLK or PLL pins. Use GR_PCLK pins when there's no PCLK pins left. PCLK_C pins are not clock capable for SE.
- Project/Equipment
- Document
- Designer
- Drawn by
- Check.by
- Copyright WUT =Copy(CurrentDate,7,4)
  This document describes Open Hardware and is licensed under the CERN-OHL-W v2
  You may redistribute and modify this documentation and make products using it under the terms of the CERN-OHL-W v2 (https:/cern.ch/cern-ohl). This documentation is distributed WITHOUT ANY EXPRESS OR IMPLIED WARRANTY, INCLUDING OF MERCHANTABILITY, SATISFACTORY QUALITY AND FITNESS FOR A PARTICULAR PURPOSE. Please see the CERN-OHL-W v2 for applicable conditions.
  Source location: =SourceLocation
  As per CERN-OHL-W v2 section 4, should You produce hardware based on these sources, You must maintain the Source Location visible on the silkscreen or top copper for a =Title1 PCB or other product you make using this documentation.
- Contact:
- File
- Last Mod.
- Print Date
- Sheet
- Size
- A3
- of
- Rev
- (in symbol LFE5U-85F-6BG554C, part A) BANK 0
- (in symbol LFE5U-85F-6BG554C, part B) BANK 1
- (in symbol LFE5U-85F-6BG554C, part C) BANK 2
- (in symbol LFE5U-85F-6BG554C, part D) BANK 3
- (in symbol LFE5U-85F-6BG554C, part E) BANK 4
- (in symbol LFE5U-85F-6BG554C, part F) BANK 6
- (in symbol LFE5U-85F-6BG554C, part G) BANK 7
- (in symbol LFE5U-85F-6BG554C, part H) BANK 8

## Library data of the parts
B1 = SMD_PAD_D0.75MM: Through Hole Pad; Part Description: 0.75mm Diameter SMD Pad; Mounted: No; Part Number: SMD_PAD_D0.75MM; Component Kind: Standard (No BOM); Component Type: Standard (No BOM); Pin Count: 1; Family: SMD Pad; Socket: No; SMD: No; Sense: No; Status: None; ComponentHeight: 0mm; HelpURL: Undefined; Author: CERN DEM BC; CreateDate: 04.06.2020; LatestRevisionDate: 04.06.2020; PackageDescription: 0.75mm Diameter SMD Pad
D13 D14 = D_TVS_DRTR5V0U4S-7: Integrated Quad Ultra-Low Capacitance ESD Protection; Part Description: Integrated Quad Ultra-Low Capacitance ESD (±8kV) Protection; Manufacturer: DIODES; PressFit: No; Bonding: No; Status Comment: Active; Part Number: DRTR5V0U4S-7; Component Kind: Standard; Component Type: Standard; Device: DRTR5V0U4S-7; PackageDescription: SOT363, SC70-6, 0.65mm Pitch; 6 Pin, 1.25mm W X 2.00mm L X 1.10mm H body, IPC Medium Density; Status: Active; Manufacturer Part Number: DRTR5V0U4S-7; Pin Count: 6; Case: SOT363; Mounted: Yes; Socket: No; SMD: Yes; Sense: No; ComponentHeight: 1.1mm; HelpURL: \\cern.ch\dfs\Applications\Altium\Datasheets\PRTR5V0U4Y.pdf; Author: GK; CreateDate: 24.01.2017; LatestRevisionDate: 14.09.2020
IC6 = LFE5U-85F-6BG554C: Part Description: FPGA LatticeECP5 Family 84000 Cells 40nm Technology 1.1V 554-Pin CABGA Tray; Manufacturer: LATTICE SEMICONDUCTOR; PressFit: No; Bonding: No; Part Number: LFE5U-85F-6BG554C; Component Kind: Standard; Component Type: Standard; Device: LFE5U-85F-6BG554C; PackageDescription: BGA, 0.80mm Pitch, Square; 554Pin, 26 Columns X 26 Rows, 23mm X 23mm X 1.76mm H; Manufacturer Part Number: LFE5U-85F-6BG554C; Pin Count: 554; Case: BGA554; Mounted: Yes; Socket: No; SMD: Yes; Sense: No; ComponentHeight: 1.76mm; HelpURL: \\cern.ch\dfs\Applications\Altium\Datasheets\LFE5U-85F-6BG554C.pdf; ComponentLink1URL: \\cern.ch\dfs\Applications\Altium\Datasheets\LATTICE_Package.pdf; ComponentLink1Description: Package Drawing; ComponentLink2URL: \\cern.ch\dfs\Applications\Altium\Datasheets\LFE5U-85F-6BG554C_Pinout.pdf; ComponentLink2Description: Pinout; Author: CERN DEM HF; CreateDate: 18.02.2022; LatestRevisionDate: 18.02.2022
R22 R24 R26-R28 R32 R38 R48 R51 R53 R56 R57 R61 R63 R65-R67 R69 R71 R72 R74 R80 R82-R84 R86 R88-R90 R94 R101-R103 R105 R107-R109 R111 R113-R115 R117 R119-R121 R123 R129 R130 R133 R144 R145 R147 R148 R150 R151 R153 R154 R156 R157 R159 R160 R162 R163 R165 R247 R249 R250 R252 R253 R255 R256 R258 R259 R261 R273 R275 R276 R278 R279 R281 = R0201_165R_1%_0.05W_200PPM: Resistor - 1%; Part Description: Thick Film Chip Resistor; Manufacturer: GENERIC; Manufacturer1 Part Number: CRCW0201165RFNED; Power: 0.05W; TC: ±200ppm/°C; PressFit: No; Part Number: R0201_165R_1%_0.05W_200PPM; Component Kind: Standard; Component Type: Standard; Pin Count: 2; Value: 165; Status: Not Recommended; Manufacturer Part Number: R0201_165R_1%_0.05W_200PPM; Case: 0201; Mounted: Yes; Sense: No; Socket: No; SMD: Yes; Manufacturer1 Example: VISHAY; Manufacturer1 ComponentHeight: 0.27mm; HelpURL: \\cern.ch\dfs\Applications\Altium\Datasheets\R0201_VISHAY_CRCW e3.pdf; Author: CERN DEM MR; CreateDate: 26.01.2016; LatestRevisionDate: 26.01.2016
R23 R25 R29 R34 R52 R54 R62 R64 R68 R70 R79 R81 R85 R87 R91 R100 R104 R106 R110 R112 R116 R118 R122 R124 R134 R146 R149 R152 R155 R158 R161 R164 R248 R251 R254 R257 R260 R274 R277 R280 = R0201_140R_1%_0.05W_200PPM: Resistor - 1%; Part Description: Thick Film Chip Resistor; Manufacturer: GENERIC; Manufacturer1 Part Number: CRCW0201140RFNED; Power: 0.05W; TC: ±200ppm/°C; PressFit: No; Part Number: R0201_140R_1%_0.05W_200PPM; Component Kind: Standard; Component Type: Standard; Pin Count: 2; Value: 140; Status: Not Recommended; Manufacturer Part Number: R0201_140R_1%_0.05W_200PPM; Case: 0201; Mounted: Yes; Sense: No; Socket: No; SMD: Yes; Manufacturer1 Example: VISHAY; Manufacturer1 ComponentHeight: 0.27mm; HelpURL: \\cern.ch\dfs\Applications\Altium\Datasheets\R0201_VISHAY_CRCW e3.pdf; Author: CERN DEM MR; CreateDate: 26.01.2016; LatestRevisionDate: 26.01.2016
R229 = R0402_4k7_1%_0.0625W_100PPM: Resistor - 1%; Part Description: General Purpose Thick Film Chip Resistor; Manufacturer: GENERIC; Manufacturer1 Part Number: 232270674702L; TC: ±100ppm/°C; PressFit: No; Part Number: R0402_4K7_1%_0.0625W_100PPM; Component Kind: Standard; Component Type: Standard; Pin Count: 2; Value: 4k7; Status: Not Recommended; Power: 0.0625W; Tolerance: ±1%; Manufacturer Part Number: R0402_4K7_1%_0.0625W_100PPM; Case: 0402; Mounted: Yes; Sense: No; Socket: No; SMD: Yes; Manufacturer1 Example: YAGEO PHYCOMP; Manufacturer1 ComponentHeight: 0.4mm; HelpURL: \\cern.ch\dfs\Applications\Altium\Datasheets\R0402_Phycomp_RC0402.pdf; Author: CERN DEM JLC; CreateDate: 03.12.2007; LatestRevisionDate: 17.10.2012